# EAGLE design ir-sensor-breakout-mk-2.3-smd (EAGLE 6.5.0)
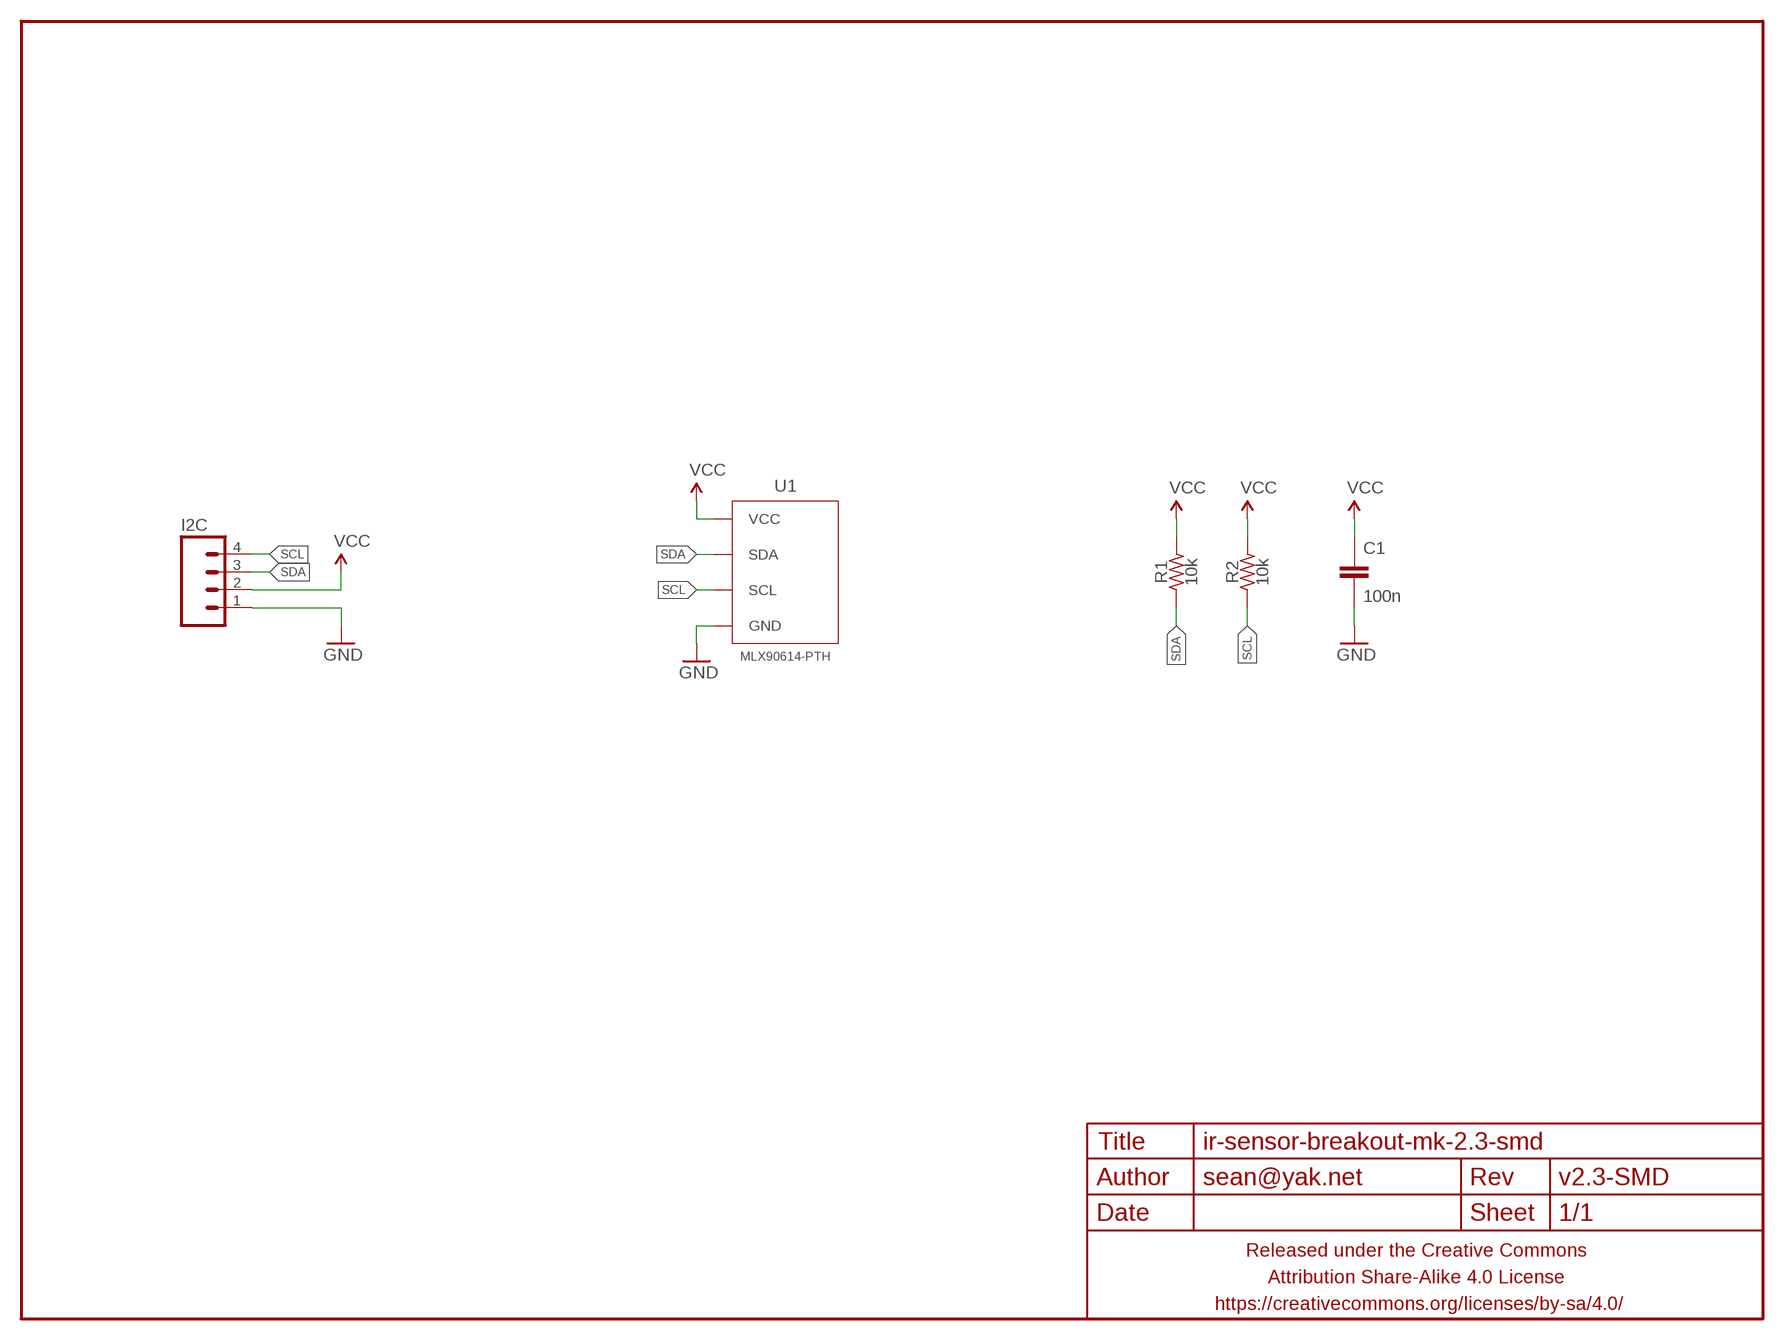
[diagram p0: schematic, sheet 1]

## Parts
C1  100n  CAPACITOR-CERAMICC0805  [C0805]
FRAME1  FRAME-LETTERNO_PACKAGE  [DUMMY]
I2C  M04JST-PTH-VERT  [JST-4-PH-VERT-PTH]
R1  10k  RESISTORR0805  [R0805]
R2  10k  RESISTORR0805  [R0805]
U1  MLX90614-PTH  MLX906145V-PTH  [TO-39-4]

## Nets
GND: C1.2 I2C.1 U1.4(GND)
SCL: I2C.4 R2.1 U1.1(SCL)
SDA: I2C.3 R1.1 U1.2(SDA)
VCC: C1.1 I2C.2 R1.2 R2.2 U1.3(VCC)

## Library data of the parts
C1 = a_parts:CAPACITOR-CERAMIC: CAPACITOR, European symbol
FRAME1 = A_butts:FRAME-LETTER: Schematic Frame Standard 8.5x11 US Letter frame; DESIGNER: sean@yak.net; VERSION: v2.3-SMD
I2C = A_butts:M04: Header 4 Standard 4-pin 0.1" header. Use with straight break away headers (SKU : PRT-00116), right angle break away headers (PRT-00553), swiss pins (PRT-00743), machine pins (PRT-00117), and female headers (PRT-00115). Molex polarized connector foot print use with SKU : PRT-08231 with associated crimp pins and housings. 1MM SMD Version SKU: PRT-10208
R1 R2 = a_parts:RESISTOR: RESISTOR, American symbol
U1 = A_butts:MLX90614

## Board
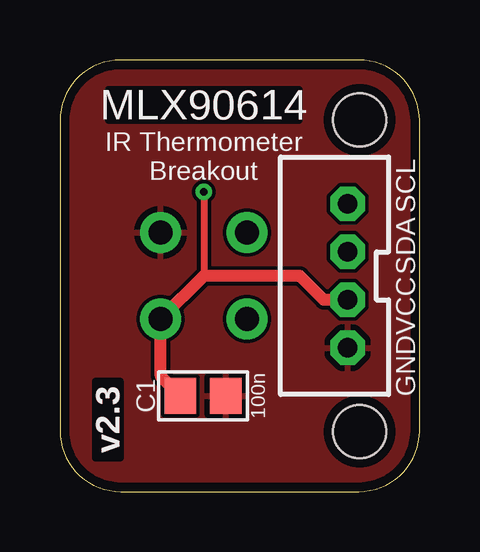
[diagram p1: board, top side]
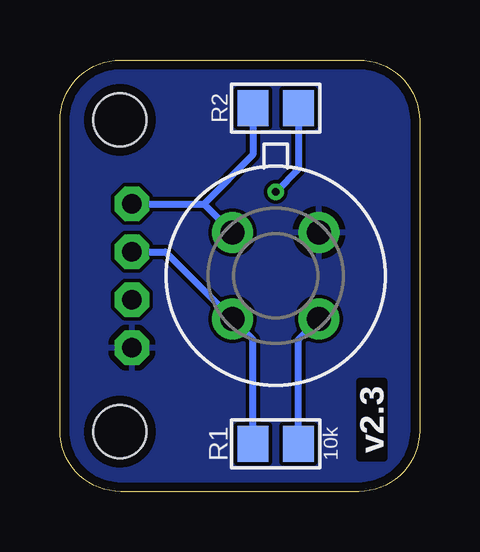
[diagram p2: board, bottom side, seen from below]

Size 15 x 18 mm. Coordinates in mm from the lower left corner, seen from the top.
Outline: 0,15.46 0,2.54 arc90 2.54,0 12.46,0 arc90 15,2.54 15,15.46 arc90 12.46,18 2.54,18 arc90 0,15.46
Copper layers (1*16): Top 0.0356mm / dielectric 1.5011mm / Bottom 0.0356mm
Design rules "LaenPCBOrder_2": minimum track width 6mil, minimum drill 13mil, track to track 6mil, track to pad 6mil, pad to pad 6mil, via to via 6mil, smd to smd 6mil, copper to edge 15mil, drill to drill 6mil, minimum pad ring 7mil, minimum via ring 7mil, stop-mask expansion 3mil, vias tented up to drill 20mil, thermal gap 10mil
Holes 2.2 mm at 12.5,2.5 12.5,15.5

### Footprints (pad centres in the part's own frame; a part is rotated, then mirrored left to right if it is on the bottom)
C0805 = smd 1.3 x 1.5: 1 -0.95,0; 2 0.95,0
JST-4-PH-VERT-PTH = drill 0.8 pad 1.422 octagon: 1 0,0; 2 2,0; 3 4,0; 4 6,0
R0805 = smd 1.3 x 1.5: 1 -0.95,0; 2 0.95,0
TO-39-4 = drill 1 pad 1.7: 1 -1.8,1.8; 2 -1.8,-1.8; 3 1.8,-1.8; 4 1.8,1.8

### Placement (x,y rotation side)
C1  5.97,4 0 top
FRAME1  0,0 0 top
I2C  12,6 90 top
R1  6,2 0 bottom
R2  6,16 0 bottom
U1  6,9 0 bottom

### Tracks (layer width: path | path; a pad name or v marks a point on that pad's centre or on a via)
GND
  pour Top: 0,15.46 0,2.54 arc90 2.54,0 12.46,0 arc90 15,2.54 15,15.46 arc90 12.46,18 2.54,18 arc90
  pour Bottom: 2.54,18 12.46,18 arc-90 15,15.46 15,2.54 arc-90 12.46,0 2.54,0 arc-90 0,2.54 0,15.46 arc-90
SCL
  Bottom 0.3: I2C.4 9,12 | 9,12 U1.1 | R2.1 6.95,14.05 9,12
SDA
  Bottom 0.3: R1.1 6.95,6.35 U1.2 10.6,10 I2C.3
VCC  (via drill 0.33)
  Top 0.3: v6,12.5 6,9
  Top 0.5: I2C.2 11,8 10,9 6,9 U1.3 4.2,4.82 C1.1
  Bottom 0.3: R1.2 5.05,6.35 U1.3 | R2.2 5.05,13.45 v6,12.5

### Text on the board
Top: MLX90614
tPlace: MLX90614 | IR Thermometer / Breakout | SCL | SDA | VCC | GND